# EasyEDA Pro project ProProject_Quantum Mega_v0.2_2024-08-26.epro, board MainPCB
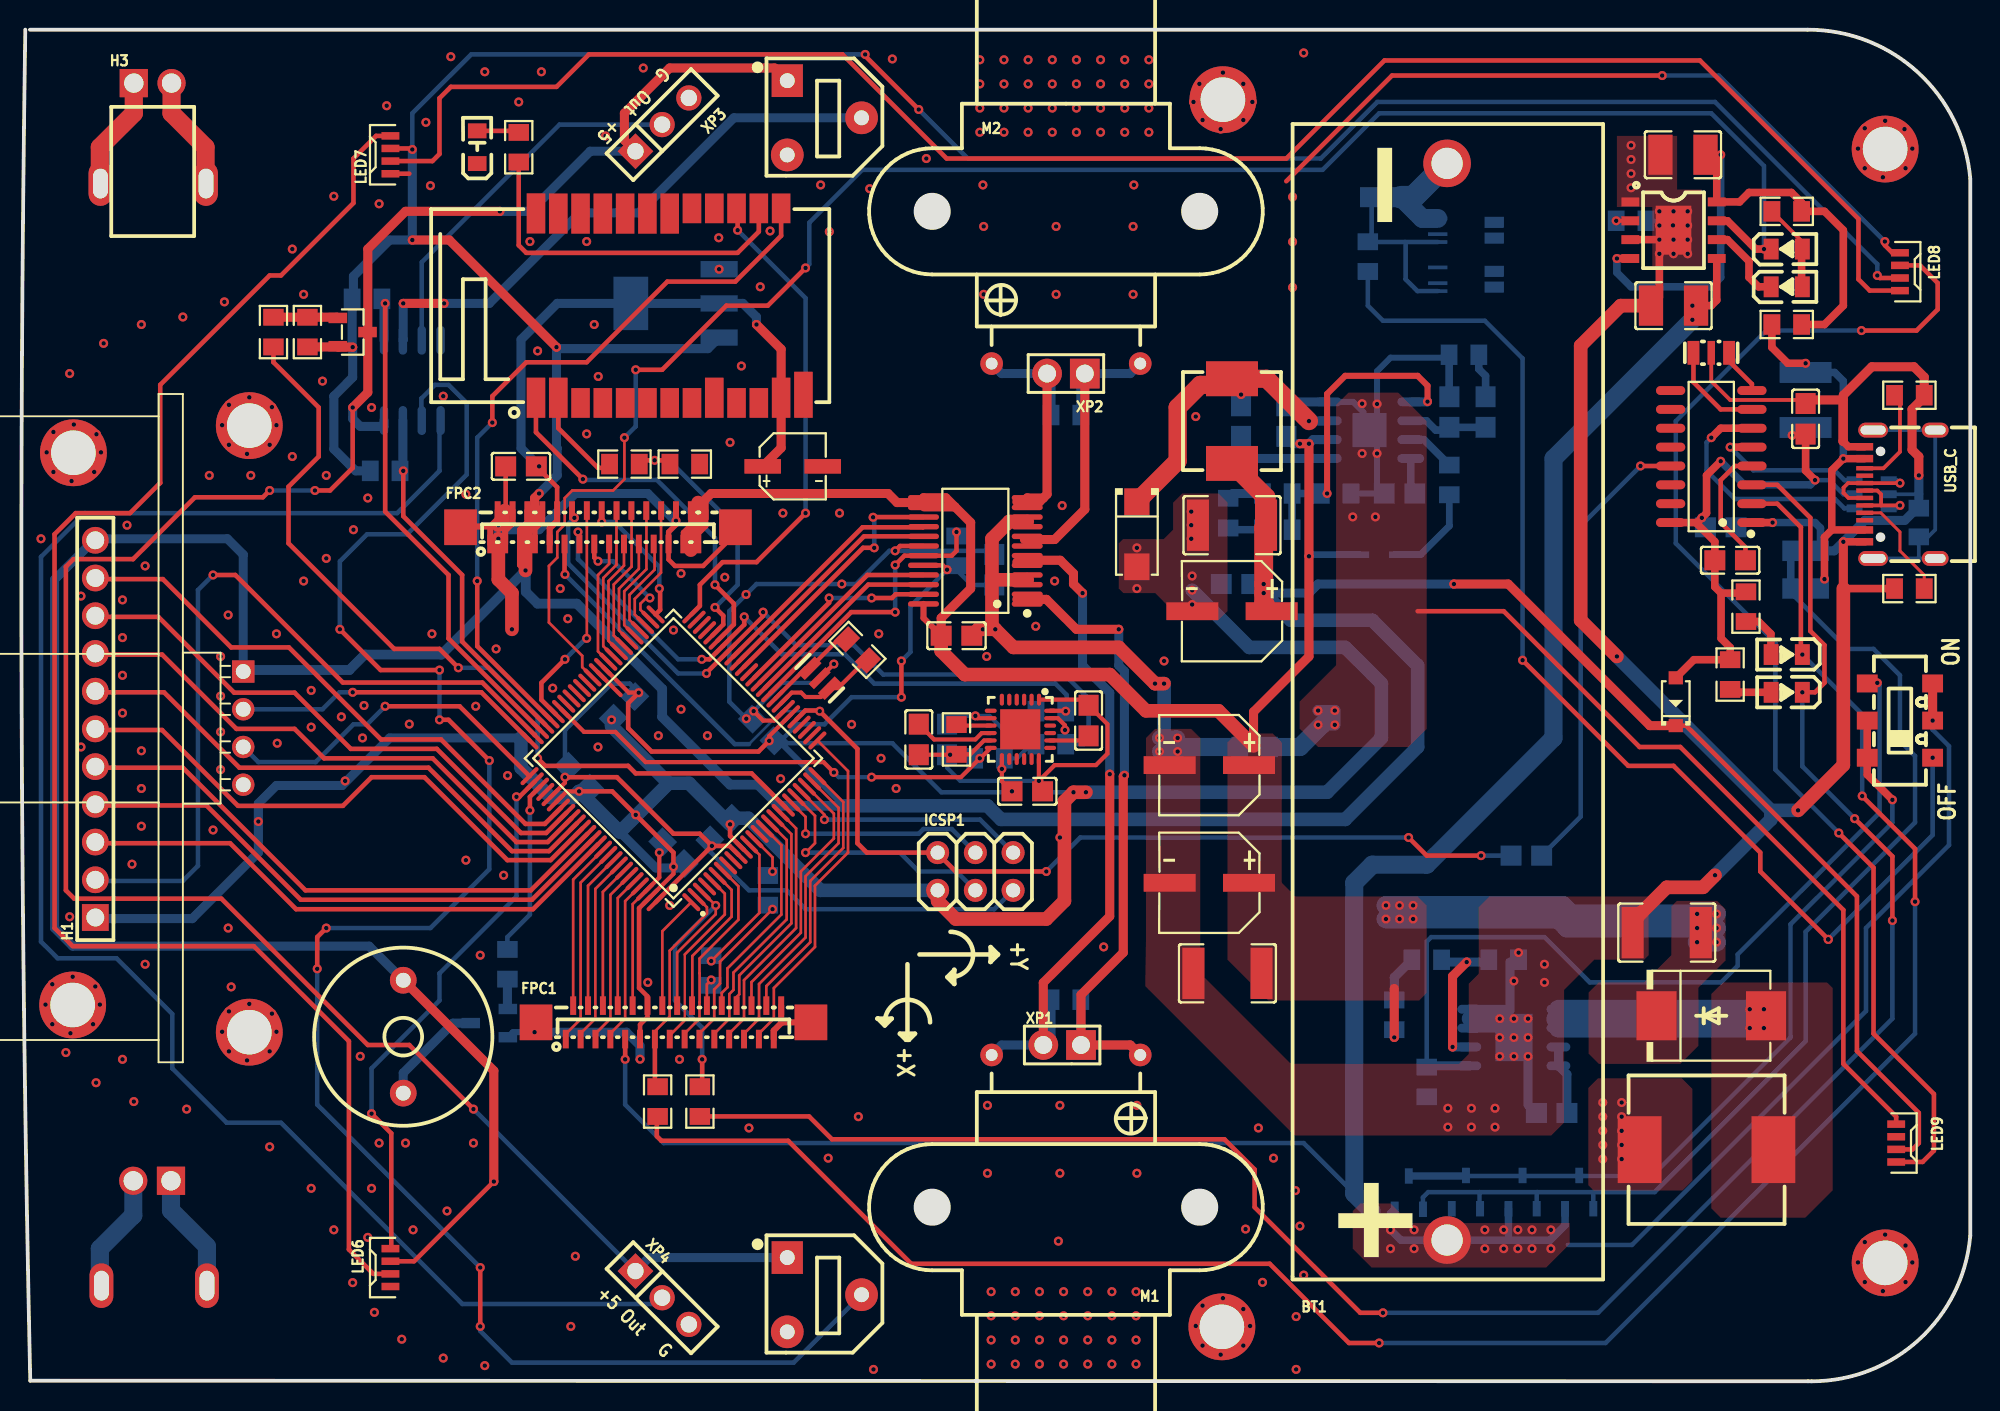
[diagram p3: board, top side]
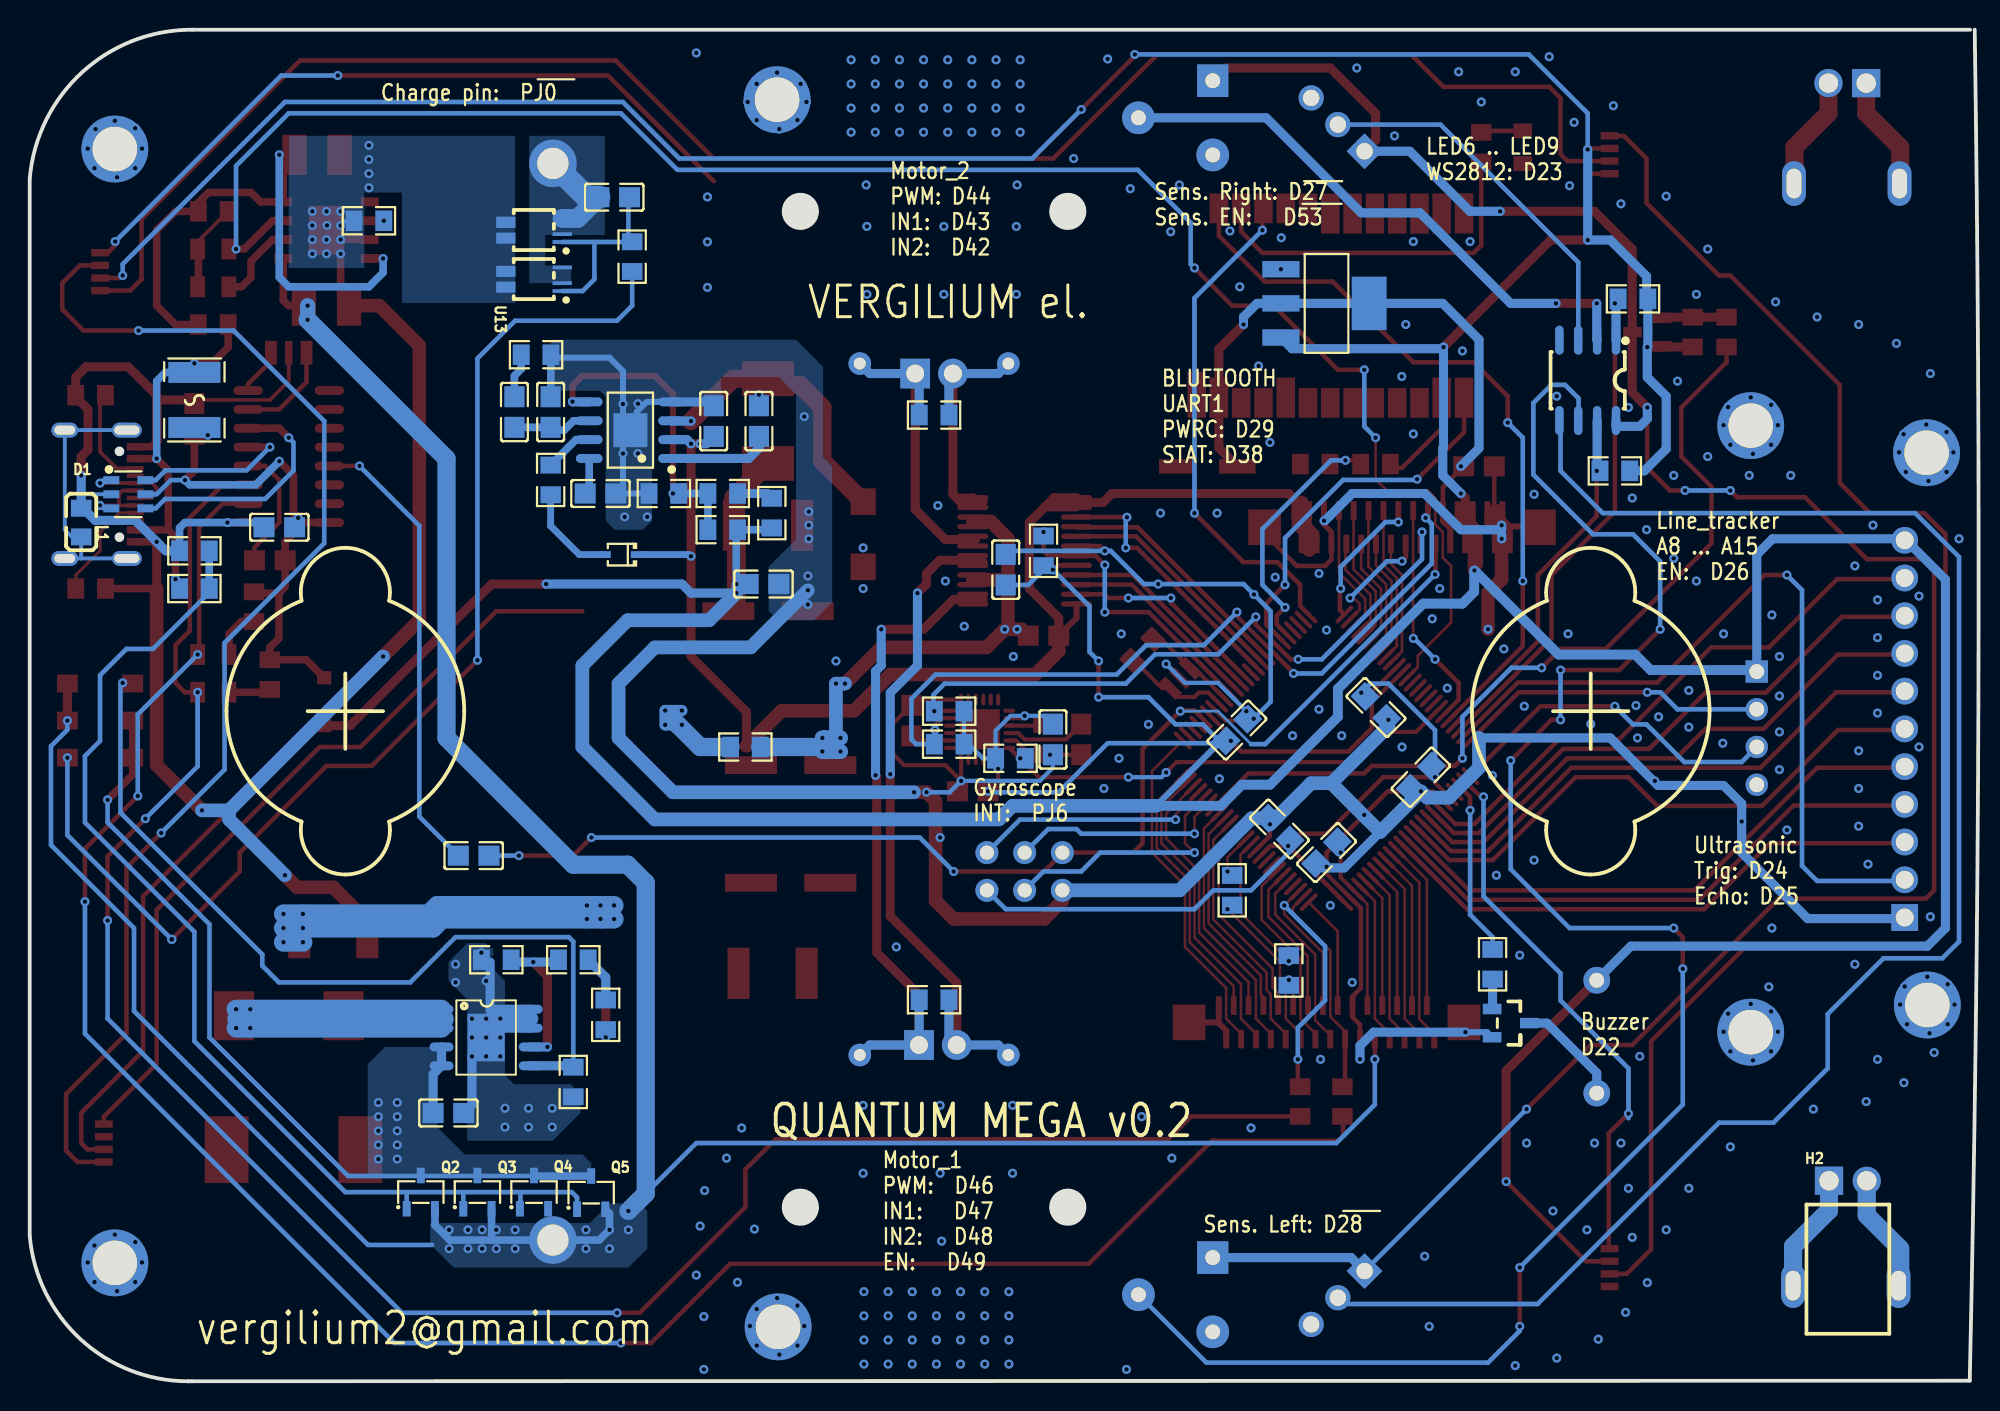
[diagram p4: board, bottom side, seen from below]

Outline 130.61 x 91.01 mm; copper layers: Top Layer, Bottom Layer. Coordinates in mm from the lower left corner of the outline.
Outline path: 0.02,91.01 119.66,91.01 arc(127.1,88.13) 130.61,80.97 130.61,9.8 arc(127.18,2.82) 119.93,0 arc(119.81,0) 119.7,0 0.04,0.04 arc(0,45.53) 0.02,91.01
Stack: Top Layer 0.035mm / Dielectric1 1.51mm FR4 er 4.5 / Bottom Layer 0.035mm

## Design rules (mm)
template: Custom Config
spacing copperThickness1oz (default): track to track 0.102, other pairs 0.152 to 0.3
spacing copperThickness2oz: track to track 0.203, other pairs 0.152 to 0.3
track width copperThickness1oz (default): min 0.127, default 0.254, max 2.54
track width copperThickness2oz: min 0.203, default 0.254, max 2.54
differential pair differentialPair (default): width min 0.127, default 0.254, max 2.54; gap min 0.152, default 0.152
via viaSize (default): diameter min 0.5, default 0.61, max 10; hole min 0.3, default 0.305, max 6.3
net GND uses copperRegionMy

## Placement (name value [footprint] x y rotation side)
BT1  BH-18650-A5BJ001  [bat-th_18650-a5bj001]  95.4 45.76 90 top
BUZZER1  buzzer-12X9  [BUZ-TH_BD12.0-P7.60-D0.6-FD]  25.14 23.2 270 top
C1  0.1u  [C0805]  64.92 54.65 90 bottom
C2  0.1u  [C0805]  62.38 50.2 0 top
C3  10n  [R0805]  69.74 65.06 180 bottom
C4  10n  [R0805]  69.74 25.69 180 bottom
C5  0.1u  [C0805]  36.98 40.68 314.1 bottom
C6  0.1u  [C0805]  40 45.38 225 bottom
C7  0.1u  [C0805]  49.36 43.85 135 bottom
C8  0.1u  [C0805]  46.5 37.19 45 bottom
C9  0.1u  [C0805]  43.33 35.6 315 bottom
C10  0.1u  [C0805]  119.53 64.81 90 top
C11  0.1u  [C0805]  113.81 57.51 180 bottom
C12  0.1u  [C0805]  114.45 55.28 180 top
C13  0.1u  [C0805]  100.73 35.4 180 bottom
C14  10uF  [C1210]  110.64 72.43 0 top
C15  10uF  [C1210]  111.27 82.59 0 top
C16  1uF  [C0805]  102.43 18.07 180 bottom
C17  22uF  [C1812]  80.62 27.47 180 top
C18  22uF  [C1812]  110.18 30.21 0 top
C19  220UF/16V  [CAP-SMD_BD6.3-L6.6-W6.6-LS7.2-FD]  79.4 41.49 180 top
C20  220UF/16V  [CAP-SMD_BD6.3-L6.6-W6.6-LS7.2-FD]  79.4 33.57 180 top
C21  0.1u  [C0805]  92.2 59.78 180 bottom
C22  10n  [C0805]  81.53 64.66 270 bottom
C23  22u  [C1812]  80.92 57.65 0 top
C24  220uF  [CAP-SMD_BD6.3-L6.6-W6.6-LS7.2-FD]  80.92 51.86 180 top
C25  3.9n  [C0805]  97.99 65.27 90 bottom
C26  (optional)  [C0805]  95.55 65.27 90 bottom
C27  0.1u  [C0805]  33.07 61.61 180 top
C28  10u  [CAP-SMD_BD4.0-L4.3-W4.3-LS5.3-FD]  51.36 61.61 0 top
C29  0.1u  [C0805]  81.23 53.68 180 bottom
C30  0.1u  [C0805]  91.27 79.73 180 bottom
C31  2.2n  [C0805]  71.27 44.49 90 top
C32  0.1u  [C0805]  67.14 39.73 0 top
C33  0.1u  [C0805]  59.84 43.22 270 top
C34  10n  [C0805]  61.74 43.22 270 bottom
C35  0.1u  [C0805]  84.58 64.66 270 bottom
D1  USBLC6-2SC6  [SOT-23-6_L2.9-W1.6-P0.95-LS2.8-BL]  123.97 59.73 270 bottom
D2  MBR0520  [SOD-123_L2.7-W1.6-LS3.7-FD]  110.79 45.76 270 top
D3  B130L-13-F  [SMA_L4.4-W2.6-LS5.0-RD]  74.52 57.04 270 top
D4  BZT52C5V1SG  [SOD-323_L1.7-W1.3-LS2.7-RD]  90.83 55.67 0 bottom
D5  SS54  [SMC_L6.9-W5.9-LS7.9-RD]  113.18 24.61 0 top
FPC1  FFC05012-30SSA124W5M  [FPC-SMD_FFC05012-30SSA124W5M]  43.33 24.17 0 top
FPC2  FFC05012-30SSA124W5M  [FPC-SMD_FFC05012-30SSA124W5M]  38.25 57.51 0 top
FU1  MF-MSMF050-2  [F1812]  119.53 66.08 270 bottom
H1  PM2.54-1*11  [HDR-TH_11P-P2.54-V-F]  4.42 43.93 90 top
H2  A2541HWR-2P  [HDR-TH_2P-P2.54-H-W8.7_A2541HWR-2P]  8.24 13.5 180 bottom
H3  A2541HWR-2P  [HDR-TH_2P-P2.54-H-W8.7_A2541HWR-2P]  8.28 87.42 0 top
ICSP1  3x2M  [2X03]  63.65 34.33 180 top
L1  BLM21BD152SH1D  [L0805]  127.15 57.82 270 bottom
L2  10uH  [IND-SMD_L7.2-W6.6_GPSR07X0]  80.92 64.66 270 top
L3  2.2uH  [IND-SMD_L10.5-W10.0]  112.86 15.6 0 top
LED1  Tx  [LED0805-R-RD_GREEN]  118.26 48.93 180 top
LED2  Rx  [LED0805-R-RD_GREEN]  118.26 46.39 180 top
LED3  CHRG  [LED0805-R-RD_GREEN]  118.26 76.24 0 top
LED4  STBY  [LED0805-R-RD_GREEN]  118.26 73.7 0 top
LED5  BT  [LED0805-RD_GREEN]  30.12 83.1 90 top
LED6  WS2812E-4020  [LED-SMD_4P-L4.0-W1.7-R]  24.28 7.66 90 top
LED7  WS2812E-4020  [LED-SMD_4P-L4.0-W1.7-R]  24.28 82.59 90 top
LED8  WS2812E-4020  [LED-SMD_4P-L4.0-W1.7-R]  125.88 74.72 270 top
LED9  WS2812E-4020  [LED-SMD_4P-L4.0-W1.7-R]  125.62 16.04 270 top
M1  Motor_DC  [n20_dc_motor 3d]  69.74 11.72 270 top
M2  Motor_DC  [n20_dc_motor 3d]  69.74 78.78 90 top
NOREF  -  [Pad_e927]  11.93 6.44 0 top
NOREF#2  -  [Pad_e1118]  80.24 3.67 0 top
NOREF#3  -  [Pad_e1115]  124.88 82.98 0 top
NOREF#4  -  [Pad_e4633]  14.78 23.51 0 top
NOREF#5  -  [Pad_e4632]  2.94 62.52 0 top
NOREF#6  -  [Pad_e2358]  11.86 80.65 0 top
NOREF#7  -  [Pad_e1117]  124.88 7.97 0 top
NOREF#8  -  [Pad_e917]  4.82 6.44 0 top
NOREF#9  -  [Pad_e3813]  80.31 86.3 0 top
NOREF#10  -  [Pad_e4634]  2.89 25.34 0 top
NOREF#11  -  [Pad_e4631]  14.78 64.35 0 top
NOREF#12  -  [Pad_e2354]  4.76 80.65 0 top
Q1  BC817  [SOT-23(SOT-23-3)]  30.93 24.12 270 bottom
Q2  RM3401  [SOT-23-3_L2.9-W1.3-P1.90-LS2.8-BR]  104.29 12.74 270 bottom
Q3  RM3401  [SOT-23-3_L2.9-W1.3-P1.90-LS2.8-BR]  100.48 12.74 270 bottom
Q4  RM3401  [SOT-23-3_L2.9-W1.3-P1.90-LS2.8-BR]  96.67 12.74 270 bottom
Q5  RM3401  [SOT-23-3_L2.9-W1.3-P1.90-LS2.8-BR]  92.82 12.7 270 bottom
Q6  IRLML6402  [SOT-23-3_L2.9-W1.3-P1.90-LS2.4-BR]  21.74 70.65 180 top
R0  000  [R0805]  82.44 42.71 0 bottom
R1  1k  [R0805]  32.15 28.08 90 bottom
R2  1M  [R0805]  55.71 49.25 135 top
R3  5.1k  [R0805]  126.51 53.38 0 top
R4  5.1k  [R0805]  126.51 66.4 180 top
R5  1k  [R0805]  115.52 52.16 270 top
R6  1k  [R0805]  114.45 47.59 270 top
R7  1k  [R0805]  42.26 18.84 270 top
R8  1k  [R0805]  45.11 18.84 270 top
R9  10k  [R0805]  62.38 55.92 90 bottom
R10  0.3  [R0805]  118.26 71.16 0 top
R11  1.2k  [R0805]  107.78 78.14 0 bottom
R12  1k  [R0805]  118.26 78.78 0 top
R13  1k  [R0805]  90.06 75.73 270 bottom
R14  1k  [R0805]  119.53 53.38 0 bottom
R15  100k  [R0805]  119.53 55.92 0 bottom
R16  100k  [R0805]  94.03 20.16 90 bottom
R17  82k  [R0805]  94.03 28.39 0 bottom
R18  10k  [R0805]  99.21 28.39 0 bottom
R19  10k  [R0805]  95.55 60.69 90 bottom
R20  6.8k  [R0805]  96.53 69.12 0 bottom
R21  82k  [R0805]  83.97 59.78 180 bottom
R22  82k  [R0805]  83.97 57.34 180 bottom
R23  10k  [R0805]  87.93 59.78 180 bottom
R24  100  [R0805]  45.87 27.66 270 bottom
R25  100  [R0805]  49.68 33.06 270 bottom
R26  10k  [R0805]  62.38 43.22 270 top
R27  10k  [R0805]  64.6 41.95 180 bottom
R28  10k  [R0805]  68.73 45.12 180 bottom
R29  10k  [R0805]  68.73 42.9 180 bottom
R30  10k  [R0805]  22.7 72.89 0 bottom
R31  10k  [RES-ADJ-SMD_RM065-V1]  53.49 85.08 270 top
R32  10k  [R0805]  23.92 61.3 0 bottom
R33  10k  [RES-ADJ-SMD_RM065-V1]  53.49 5.83 270 top
R34  2k  [R0805]  44.09 61.76 180 top
R35  1k  [R0805]  40.03 61.76 180 top
R36  470  [R0805]  32.91 83.1 90 top
R37  47k  [R0805]  18.69 70.65 90 top
R38  2.2k  [R0805]  16.4 70.65 90 top
R39  5.1k  [R0805]  91.84 24.68 90 bottom
R40  5.1k  [R0805]  80.67 58.46 90 bottom
SW2  PWR  [SW-SMD_NIDEC_CL-SB-22B-XX]  125.88 44.49 90 top
U1  ATMEGA2560-16AU  [TQFP-100_L14.0-W14.0-P0.50-LS16.0-BL]  43.33 41.95 45 top
U2  CH340G  [SOIC-16_L9.9-W3.9-P1.27-LS6.0-BL]  113.18 62.27 90 top
U3  JDY-24M  [BULETM-SMD_JDY-24M]  43.07 72.43 90 top
U4  TB6612FNG  [SSOP-24_L8.4-W5.8-P0.65-LS7.8-BL]  63.65 55.92 90 top
U5  HC-SR04  [ULTRASONIC-HC-SR04#V]  14.37 43.98 270 top
U6  TP4056  [ESOP-8_L4.9-W3.9-P1.27-LS6.0-BL-EP]  110.64 77.51 270 top
U7  XB7608AJ  [CPC-5_L2.6-W2.6-P0.53-LS4.0-BL]  96.67 77.51 90 bottom
U8  XR2981  [SO-8_L4.9-W3.9-P1.27-LS6.0-BL-EP]  99.89 23.15 270 bottom
U9  MP2307DN  [SOP-8_L4.9-W3.9-P1.27-LS6.0-BL-EP]  90.18 64.04 90 bottom
U10  AMS1117-3.3  [SOT-223-3_L6.5-W3.4-P2.30-LS7.0-BR]  43.43 72.58 0 bottom
U11  MPU-6050  [QFN-24_L4.0-W4.0-P0.50-BL-EP2.7]  66.68 43.9 180 top
U12  LM393DR2G  [SOIC-8_L5.0-W4.0-P1.27-LS6.0-BL]  25.75 67.4 0 bottom
U13  XB7608AJ  [CPC-5_L2.6-W2.6-P0.53-LS4.0-BL]  96.67 74.21 90 bottom
USB_C  USB-C-SMD-DIP_TYPEC-缩减引脚  [USB-C-SMD_C9900005364]  125.88 59.73 90 top
X1  16MHz  [OSC-SMD_3P-L3.2-W1.3-P0.95-L]  53.17 47.35 135 top
X2  12MHz  [CRYSTAL-SMD_3P-L3.2-W1.3-P1.2-L]  113.18 69.25 180 top
XP1  2.54-1*2  [HDR-TH_2P-P2.54-V-M]  69.49 22.65 180 top
XP2  2.54-1*2  [HDR-TH_2P-P2.54-V-M]  69.74 67.86 180 top
XP3  D32  [HDR-TH_3P-P2.54-V-M]  42.57 84.62 45 top
XP4  D32  [HDR-TH_3P-P2.54-V-M]  42.57 5.63 315 top

## Footprints (pads in the part's own frame, mm; a bottom-side part is the same pattern mirrored in y, then rotated)
2X03
  rrect 1.55x1.55 hole 0.95: 1(-2.54,-1.27) 2(-2.54,1.27) 3(0,-1.27) 4(0,1.27) 5(2.54,-1.27) 6(2.54,1.27)
bat-th_18650-a5bj001
  round 3.2 hole 2.1: 1(-36.25,0) 2(36.25,0)
BULETM-SMD_JDY-24M
  rect 2.7x1.25 smd: 1(-6.2,9) 2(-6.2,7.5) 9(-6.2,-3) 12(-6.2,-7.5) 19(6.2,0) 20(6.2,1.5) 21(6.2,3) 22(6.2,4.5) 23(6.2,6) 24(6.2,7.5) 25(6.21,9)
  rect 2x1.25 smd: 3(-6.55,6) 4(-6.55,4.5) 5(-6.55,3) 6(-6.55,1.5) 7(-6.55,0) 8(-6.55,-1.5) 10(-6.55,-4.5) 11(-6.55,-6) 14(6.55,-7.5) 15(6.55,-6) 16(6.55,-4.5) 17(6.55,-3) 18(6.55,-1.5)
  rect 3.1x1.25 smd: 13(-6,-9)
BUZ-TH_BD12.0-P7.60-D0.6-FD
  round 1.8 hole 1: 1(-3.8,0) 2(3.8,0)
C0805
  rect 1.41x1.35 smd: 1(-1.03,0) 2(1.03,0)
C1210
  rect 1.635x2.7 smd: 1(-1.518,0) 2(1.518,0)
C1812
  rect 1.485x3.456 smd: 1(-2.292,0) 2(2.292,0)
CAP-SMD_BD4.0-L4.3-W4.3-LS5.3-FD
  rect 2.46x0.98 smd: 1(-2.02,0) 2(2.02,0)
CAP-SMD_BD6.3-L6.6-W6.6-LS7.2-FD
  rect 3.5x1.2 smd: 1(-2.67,0) 2(2.67,0)
CPC-5_L2.6-W2.6-P0.53-LS4.0-BL
  rect 0.25x1.3 smd: 1(-0.795,-1.9) 2(-0.265,-1.9) 3(0.795,-1.9)
  rect 0.75x1.3 smd: 4(0.53,1.9) 5(-0.53,1.9)
CRYSTAL-SMD_3P-L3.2-W1.3-P1.2-L
  rect 0.8x1.6 smd: 1(-1.199,0) 3(1.199,0)
  rect 0.5x1.6 smd: 2(0,0)
ESOP-8_L4.9-W3.9-P1.27-LS6.0-BL-EP
  rect 0.6x1.2 smd: 1(-1.905,-2.909) 2(-0.635,-2.909) 3(0.635,-2.909) 4(1.905,-2.909) 5(1.905,2.909) 6(0.635,2.909) 7(-0.635,2.909) 8(-1.905,2.909)
  rect 3.3x2.4 smd: 9(0,0)
F1812
  rect 1.407x3.499 smd: 1(-1.853,0) 2(1.853,0)
FPC-SMD_FFC05012-30SSA124W5M
  rect 0.4x1.25 smd: 1(-7.25,-1.125) 2(-6.75,1.125) 3(-6.25,-1.125) 4(-5.75,1.125) 5(-5.25,-1.125) 6(-4.75,1.125) 7(-4.25,-1.125) 8(-3.75,1.125) 9(-3.25,-1.125) 10(-2.75,1.125) 11(-2.25,-1.125) 12(-1.75,1.125) 13(-1.25,-1.125) 14(-0.75,1.125) 15(-0.25,-1.125) 16(0.25,1.125) 17(0.75,-1.125) 18(1.25,1.125) 19(1.75,-1.125) 20(2.25,1.125) 21(2.75,-1.125) 22(3.25,1.125) 23(3.75,-1.125) 24(4.25,1.125) 25(4.75,-1.125) 26(5.25,1.125) 27(5.75,-1.125) 28(6.25,1.125) 29(6.75,-1.125) 30(7.25,1.125)
  rect 2.2x2.4 smd: 31(9.25,0) 32(-9.25,0)
HDR-TH_2P-P2.54-H-W8.7_A2541HWR-2P
  rect 1.9x1.9 hole 1.3: 1(-1.27,0)
  round 1.9 hole 1.3: 2(1.27,0)
HDR-TH_2P-P2.54-V-M
  rect 2x2 hole 1.2: 1(-1.27,0)
  round 2 hole 1.2: 2(1.27,0)
HDR-TH_3P-P2.54-V-M
  rect 1.7x1.7 hole 1.1: 1(-2.54,0)
  round 1.7 hole 1.1: 2(0,0) 3(2.54,0)
HDR-TH_11P-P2.54-V-F
  rect 1.8x1.8 hole 1.2: 1(-12.7,0)
  round 1.8 hole 1.2: 2(-10.16,0) 3(-7.62,0) 4(-5.08,0) 5(-2.54,0) 6(0,0) 7(2.54,0) 8(5.08,0) 9(7.62,0) 10(10.16,0) 11(12.7,0)
IND-SMD_L7.2-W6.6_GPSR07X0
  rect 2.35x3.5 smd: 1(-2.85,0) 2(2.85,0)
IND-SMD_L10.5-W10.0
  rect 2.95x4.5 smd: 1(-4.5,0) 2(4.5,0)
L0805
  rect 1.133x1.377 smd: 1(-0.966,0) 2(0.966,0)
LED0805-R-RD_GREEN
  rect 1x1.399 smd: 1(1.05,0) 2(-1.05,0)
LED0805-RD_GREEN
  rect 1x1.25 smd: 1(-1.1,0) 2(1.1,0)
LED-SMD_4P-L4.0-W1.7-R
  rect 0.5x1.2 smd: 1(1.275,0) 2(0.425,0) 3(-0.425,0) 4(-1.275,0)
n20_dc_motor 3d
  round 1.524 hole 0.8: 1(-10.25,5) 2(-10.25,-5)
OSC-SMD_3P-L3.2-W1.3-P0.95-L
  rect 0.65x1.6 smd: 1(-0.95,0) 3(0.95,0)
  rect 0.5x1.6 smd: 2(0,0)
Pad_e917
  oval 1.6x3 hole 1x2: 102(0,0)
Pad_e927
  oval 1.6x3 hole 1x2: 103(0,0)
Pad_e1115
  round 4.5 hole 3: 101(0,0)
Pad_e1117
  round 4.5 hole 3: 101(0,0)
Pad_e1118
  round 4.5 hole 3: 101(0,0)
Pad_e2354
  oval 1.6x3 hole 1x2: 102(0,0)
Pad_e2358
  oval 1.6x3 hole 1x2: 103(0,0)
Pad_e3813
  round 4.5 hole 3: 101(0,0)
Pad_e4631
  round 4.5 hole 3: 101(0,0)
Pad_e4632
  round 4.5 hole 3: 101(0,0)
Pad_e4633
  round 4.5 hole 3: 101(0,0)
Pad_e4634
  round 4.5 hole 3: 101(0,0)
QFN-24_L4.0-W4.0-P0.50-BL-EP2.7
  oval 0.28x0.8 smd: 1(-1.25,-2) 2(-0.75,-2) 3(-0.25,-2) 4(0.25,-2) 5(0.75,-2) 6(1.25,-2) 13(1.25,2) 14(0.75,2) 15(0.25,2) 16(-0.25,2) 17(-0.75,2) 18(-1.242,2)
  oval 0.8x0.28 smd: 7(2,-1.25) 8(2,-0.75) 9(2,-0.25) 10(2,0.25) 11(2,0.75) 12(2,1.25) 19(-2,1.25) 20(-2,0.75) 21(-2,0.25) 22(-2,-0.25) 23(-2,-0.75) 24(-2,-1.25)
  rect 2.7x2.7 smd: 25(0.013,0)
R0805
  rect 1.133x1.377 smd: 1(-1,0) 2(1,0)
RES-ADJ-SMD_RM065-V1
  rect 2.2x2.1 hole 1: 1(-2.5,-2.5)
  round 2.2 hole 1: 2(0,2.5) 3(2.5,-2.5)
SMA_L4.4-W2.6-LS5.0-RD
  rect 1.8x1.7 smd: 1(-2.192,0) 2(2.192,0)
SMC_L6.9-W5.9-LS7.9-RD
  rect 2.7x3.3 smd: 1(-3.687,0) 2(3.687,0)
SO-8_L4.9-W3.9-P1.27-LS6.0-BL-EP
  oval 0.6x1.6 smd: 1(-1.905,-3) 2(-0.635,-3) 3(0.635,-3) 4(1.905,-3) 5(1.905,3) 6(0.635,3) 7(-0.635,3) 8(-1.905,3)
  rect 3.2x2.5 smd: 9(0,0)
SOD-123_L2.7-W1.6-LS3.7-FD
  rect 0.88x0.96 smd: 1(-1.61,0) 2(1.61,0)
SOD-323_L1.7-W1.3-LS2.7-RD
  rect 0.845x0.455 smd: 1(-1.097,0) 2(1.097,0)
SOIC-8_L5.0-W4.0-P1.27-LS6.0-BL
  oval 0.569x1.95 smd: 1(-1.905,-2.705) 2(-0.635,-2.705) 3(0.635,-2.705) 4(1.905,-2.705) 5(1.905,2.705) 6(0.635,2.705) 7(-0.635,2.705) 8(-1.905,2.705)
SOIC-16_L9.9-W3.9-P1.27-LS6.0-BL
  oval 0.602x1.971 smd: 1(-4.445,-2.736) 2(-3.175,-2.736) 3(-1.905,-2.736) 4(-0.635,-2.736) 5(0.635,-2.736) 6(1.905,-2.736) 7(3.175,-2.736) 8(4.445,-2.736) 9(4.445,2.736) 10(3.175,2.736) 11(1.905,2.736) 12(0.635,2.736) 13(-0.635,2.736) 14(-1.905,2.736) 15(-3.175,2.736) 16(-4.445,2.736)
SOP-8_L4.9-W3.9-P1.27-LS6.0-BL-EP
  oval 0.6x1.8 smd: 1(-1.905,-2.772) 2(-0.635,-2.772) 3(0.635,-2.772) 4(1.905,-2.772) 5(1.905,2.772) 6(0.635,2.772) 7(-0.635,2.772) 8(-1.905,2.772)
  rect 2.29x2.29 smd: 9(0,0)
SOT-23(SOT-23-3)
  rect 0.7x1.25 smd: 1(-0.95,-1.25) 2(0.95,-1.25) 3(0,1.25)
SOT-23-3_L2.9-W1.3-P1.90-LS2.4-BR
  rect 1.25x0.7 smd: 1(1,-0.95) 2(1,0.95) 3(-1,0)
SOT-23-3_L2.9-W1.3-P1.90-LS2.8-BR
  rect 1.04x0.532 smd: 1(1.12,-0.95) 2(1.12,0.95) 3(-1.12,0)
SOT-23-6_L2.9-W1.6-P0.95-LS2.8-BL
  rect 0.532x1.072 smd: 1(-0.95,-1.149) 2(0,-1.149) 3(0.95,-1.149) 4(0.95,1.149) 5(0,1.149) 6(-0.95,1.149)
SOT-223-3_L6.5-W3.4-P2.30-LS7.0-BR
  rect 2.5x1.1 smd: 1(2.97,-2.3) 2(2.97,0) 3(2.97,2.3)
  rect 2.34x3.6 smd: 4(-2.97,0)
SSOP-24_L8.4-W5.8-P0.65-LS7.8-BL
  oval 0.364x2.082 smd: 1(-3.575,-3.491) 2(-2.925,-3.491) 3(-2.275,-3.491) 4(-1.625,-3.491) 5(-0.975,-3.491) 6(-0.325,-3.491) 7(0.325,-3.491) 8(0.975,-3.491) 9(1.625,-3.491) 10(2.275,-3.491) 11(2.925,-3.491) 12(3.575,-3.491) 13(3.575,3.491) 14(2.925,3.491) 15(2.275,3.491) 16(1.625,3.491) 17(0.975,3.491) 18(0.325,3.491) 19(-0.325,3.491) 20(-0.975,3.491) 21(-1.625,3.491) 22(-2.275,3.491) 23(-2.925,3.491) 24(-3.575,3.491)
SW-SMD_NIDEC_CL-SB-22B-XX
  rect 1.2x1.4 smd: 1(-2.5,-2.2) 2(0,-2.2) 3(2.5,-2.2) 4(-2.5,2.2) 5(0,2.2) 6(2.5,2.2)
TQFP-100_L14.0-W14.0-P0.50-LS16.0-BL
  oval 0.28x1.6 smd: 1(-6,-7.7) 2(-5.5,-7.7) 3(-5,-7.7) 4(-4.5,-7.7) 5(-4,-7.7) 6(-3.5,-7.7) 7(-3,-7.7) 8(-2.5,-7.7) 9(-2,-7.7) 10(-1.5,-7.7) 11(-1,-7.7) 12(-0.5,-7.7) 13(0,-7.7) 14(0.5,-7.7) 15(1,-7.7) 16(1.5,-7.7) 17(2,-7.7) 18(2.5,-7.7) 19(3,-7.7) 20(3.5,-7.7) 21(4,-7.7) 22(4.5,-7.7) 23(5,-7.7) 24(5.5,-7.7) 25(6,-7.7) 51(6,7.7) 52(5.5,7.7) 53(5,7.7) 54(4.5,7.7) 55(4,7.7) 56(3.5,7.7) 57(3,7.7) 58(2.5,7.7) 59(2,7.7) 60(1.5,7.7) 61(1,7.7) 62(0.5,7.7) 63(0,7.7) 64(-0.5,7.7) 65(-1,7.7) 66(-1.5,7.7) 67(-2,7.7) 68(-2.5,7.7) 69(-3,7.7) 70(-3.5,7.7) 71(-4,7.7) 72(-4.5,7.7) 73(-5,7.7) 74(-5.5,7.7) 75(-6,7.7)
  oval 1.6x0.28 smd: 26(7.7,-6) 27(7.7,-5.5) 28(7.7,-5) 29(7.7,-4.5) 30(7.7,-4) 31(7.7,-3.5) 32(7.7,-3) 33(7.7,-2.5) 34(7.7,-2) 35(7.7,-1.5) 36(7.7,-1) 37(7.7,-0.5) 38(7.7,0) 39(7.7,0.5) 40(7.7,1) 41(7.7,1.5) 42(7.7,2) 43(7.7,2.5) 44(7.7,3) 45(7.7,3.5) 46(7.7,4) 47(7.7,4.5) 48(7.7,5) 49(7.7,5.5) 50(7.7,6) 76(-7.7,6) 77(-7.7,5.5) 78(-7.7,5) 79(-7.7,4.5) 80(-7.7,4) 81(-7.7,3.5) 82(-7.7,3) 83(-7.7,2.5) 84(-7.7,2) 85(-7.7,1.5) 86(-7.7,1) 87(-7.7,0.5) 88(-7.7,0) 89(-7.7,-0.5) 90(-7.7,-1) 91(-7.7,-1.5) 92(-7.7,-2) 93(-7.7,-2.5) 94(-7.7,-3) 95(-7.7,-3.5) 96(-7.7,-4) 97(-7.7,-4.5) 98(-7.7,-5) 99(-7.7,-5.5) 100(-7.7,-6)
ULTRASONIC-HC-SR04#V
  rect 1.508x1.508 hole 1: 1(-3.81,0)
  round 1.508 hole 1: 2(-1.27,0) 3(1.27,0) 4(3.81,0)
USB-C-SMD_C9900005364
  oval 1x2 hole 0.6x1.7: 1(-4.32,1.806) 1(4.32,1.806)
  oval 1x1.8 hole 0.6x1.4: 1(-4.32,-2.374) 1(4.32,-2.374)
  rect 0.5x1.14 smd: A1B12(-3.2,2.373) A4B9(-2.4,2.373) B1A12(3.2,2.373) B4A9(2.4,2.373)
  rect 0.3x1.14 smd: A5(-1.25,2.373) A6(-0.25,2.373) A7(0.25,2.373) A8(1.25,2.374) B5(1.75,2.373) B6(0.75,2.373) B7(-0.75,2.373) B8(-1.75,2.374)

## Nets
As in the schematic, except:
+3.3V: C27.1 C28.1 FPC2.9 FPC2.10 U3.12 U10.2 U10.4
+12V: C2.1 C17.1 C18.2 C19.1 C20.1 C35.2 D4.1 D5.1 FPC2.27 FPC2.28 FPC2.29 FPC2.30 R39.1 U4.13 U4.14 U4.24 U9.2
GND: C1.2 C5.2 C6.2 C7.2 C8.2 C9.2 C21.2 C23.1 C24.2 C26.2 C27.2 C28.2 C29.2 C31.2 C32.2 C33.2 C34.2 C35.1 D3.2 FPC1.11 FPC1.12 FPC1.29 FPC1.30 FPC1.31 FPC1.32 FPC2.1 FPC2.2 FPC2.3 FPC2.4 FPC2.25 FPC2.26 FPC2.31 FPC2.32 H1.1 ICSP1.6 LED5.1 LED6.4 LED7.4 LED8.4 LED9.4 NOREF#2.101 NOREF#4.101 NOREF#5.101 NOREF#9.101 NOREF#10.101 NOREF#11.101 Q1.2 R0.2 R20.1 R23.1 R26.2 R31.3 R33.3 R34.1 U1.11 U1.32 U1.62 U1.81 U1.99 U3.13 U4.18 U5.4 U9.4 U9.9 U10.1 U11.1 U11.11 U11.18 U12.4 X1.2 XP3.3 XP4.3
AREF: C9.1 FPC1.10 U1.98
IR_LINE1: H1.3 U1.89
IR_LINE2: H1.4 U1.88
IR_LINE3: H1.5 U1.87
IR_LINE4: H1.6 U1.86
IR_LINE5: H1.7 U1.85
IR_LINE6: H1.8 U1.84
IR_LINE7: H1.9 U1.83
IR_LINE8: H1.10 U1.82
SENS_L: R32.2 U1.72 U12.7
SENS_R: R30.2 U1.73 U12.1
~SENS_EN: R38.1 U1.19

Pads without a net: H2 1 2; H3 1 2; LED9 3; NOREF 103; NOREF#3 101; NOREF#6 103; NOREF#7 101; NOREF#8 102; NOREF#12 102; U1 4 8 9 14 27 28 29 39 47 48 49 64 65 66 67 68 79; U2 9 10 11 12 14 15; U3 3 4 5 6 7 8 9 10 11 17 18 19 20 21 22 23 24 25; U11 2 3 4 5 6 7 14 15 16 17 19 21 22 25; USB_C A8 B8

## Via types
v1: diameter 0.61, hole 0.305, Top Layer to Bottom Layer, 576 vias

## Routing (per net, layer and track width the routed paths; a pad name or vN(x,y) marks a point on that pad's centre or on a via; arc(x,y) is an arc through that point)
+3.3V: length 43.6
  Top Layer w0.305: FPC2.10 35.5,60.21 C27.1
  Top Layer w0.406: FPC2.9 35,57.43 35.5,57.93 FPC2.10
  Top Layer w0.61: C28.1 50.57,62.85 U3.12 50.57,69.5 v1(48.92,71.16)
  Bottom Layer w0.61: v1(34.28,61.61) 33.06,62.83 33.06,70.14 35.5,72.58 U10.4 U10.2 48,72.58 48.91,71.67 v1(48.91,71.16)
+5V: length 620.9
  Top Layer w0.28: v1(49.77,43.13) 49.77,43.44 U1.31 ; v1(66.11,39.73) 65.43,40.41 v1(65.43,41.23) U11.13 ; v1(36.02,40.68) 36.02,40.3 35.05,39.33 ; v1(63.65,44.81) 63.8,44.65 U11.8 ; U1.61 40.32,46.37 v1(40.99,46.37)
  Top Layer w0.305: v1(58.67,48.5) v1(58.67,46.06) ; U1.10 47.1,36.05 v1(45.91,36.05) ; v1(124.35,74.46) 124.52,74.29 LED8.2 ; v1(61.74,54.65) 61.45,54.94 U4.20 ; v1(56.23,89.35) 56.23,89.24 v1(59.84,85.64) ; v1(45.91,36.05) 45.09,36.87 43.33,36.87 39.52,40.68 v1(36.02,40.68) ; v1(45.91,36.05) U1.100 ; D2.2 111.48,44.15 122.98,32.65 122.98,22.24 127.15,18.07 127.15,16.04 126.72,15.62 LED9.2 ; v1(31.23,13.45) 25.87,8.08 24.28,8.08 ; v1(49.77,43.13) 49.05,42.41 41.85,42.41 40.28,43.98 40.28,45.66 v1(40.99,46.37) ; LED7.2 25.68,83.01 v1(25.75,82.95)
  Top Layer w0.355: FPC2.7 34,57.38 34.5,57.88 FPC2.8 FPC2.6
  Top Layer w0.406: FPC2.6 33.5,57.84 33,57.34 FPC2.5 33,54.97 v1(33.37,54.6)
  Top Layer w0.61: D2.2 109.04,44.15 99.51,53.68 v1(95.85,53.68) ; v1(25.75,76.85) 28.24,76.85 v1(35.45,69.64) ; v1(21.74,69.64) 20.8,69.64 Q6.2 20.74,69.65 R37.1 ; BUZZER1.1 31.23,20.91 v1(31.23,13.45) ; v1(34.28,59.78) 33.98,59.48 33.98,58.66 34,58.63
  Top Layer w0.914: 34,58.63 34,57.95 33.37,57.32 v1(33.37,54.6)
  Top Layer w1.27: 83.19,52.26 83.05,52.39 v1(83.05,53.07) v1(83.05,53.68) 83.05,57.49 C23.2 83.21,59.51 L2.2
  Bottom Layer w0.28: C34.1 62.3,44.81 v1(63.65,44.81) 64.6,44.81 65.6,43.81 R27.1 66.46,41.95 67.73,43.22 R28.2
  Bottom Layer w0.305: v1(124.35,74.46) 124.35,75.22 113.43,86.15 90.7,86.15 86.89,82.34 63.14,82.34 v1(59.84,85.64) ; v1(49.77,43.13) C7.1 ; v1(58.67,46.06) 55.31,46.06 53.49,44.24 51.66,44.24 50.55,43.13 ; 65.98,39.66 61.36,39.66 58.06,42.97 50.71,42.97 50.55,43.13 ; v1(56.23,89.35) 29.71,89.35 25.75,85.38 v1(25.75,82.95) ; 50.55,43.13 50.42,43.13 ; v1(36.02,40.68) 36.02,43.84 39.16,46.98 40.38,46.98 v1(40.99,46.37) ; C1.1 63.41,53.62 62.38,54.65 v1(61.74,54.65) 59.28,52.19 59.28,49.11 v1(58.67,48.5) ; ICSP1.2 64.92,31.79 52.22,31.79 50.95,33.06 48.41,33.06 45.77,35.69 C8.1
  Bottom Layer w0.406: 50.42,43.13 54.8,38.75
  Bottom Layer w0.508: R40.1 80.78,57.34 R22.2 83.05,57.26 v1(83.05,53.68)
  Bottom Layer w0.61: U5.1 14.37,55.67 13.3,56.73 4.41,56.73 1.67,53.99 1.67,30.52 2.89,29.3 22.84,29.3 BUZZER1.1 ; v1(95.85,53.68) 86.71,53.68 86.1,53.07 v1(83.05,53.07) v1(83.05,53.68) ; v1(34.28,59.78) 35.5,61 35.5,62.83 35.45,62.88 v1(35.45,69.64) 35.55,69.53 45.65,69.53 U10.3 ; v1(25.75,82.95) v1(25.75,76.85) 24.22,76.85 21.79,74.41 21.79,72.97 R30.1 21.7,69.67 v1(21.74,69.64) 21.74,67.6 20.47,66.33 20.47,62.78 21.94,61.3 R32.1
  Bottom Layer w0.66: 33.39,54.58 33.39,53.16 34.18,52.36 36.82,52.36 42.56,46.62 42.56,44.74 47.14,40.17 49.01,40.17 50.44,38.75 54.79,38.75 ; U5.1 14.47,47.89 21.51,47.89 22.55,48.93 27.7,48.93 v1(33.37,54.6)
  Bottom Layer w0.914: 54.79,38.75 64.46,38.75 65.37,37.83 88.54,37.83 93.41,42.71 93.41,48.2 90.37,51.25 84.88,51.25 v1(83.05,53.07) ; 50.42,43.13 C7.1
+12V: length 144.4
  Top Layer w0.355: FPC2.27 44,57.15 44.5,57.65 FPC2.28 ; FPC2.29 45,57.08 45.5,57.58 FPC2.30
  Top Layer w0.406: U4.24 60.15,51.4 C2.1
  Top Layer w0.61: C2.1 61.35,51.4 63.33,53.38 63.33,57.82 62.27,58.88 ; v1(85.49,63.13) v1(86.1,63.13) v1(86.1,55.55) 86.1,48.81 82.37,45.08 82.37,42.78 ; 60.19,58.88 62.27,58.88 ; 62.27,58.88 61.66,59.49 60.16,59.49 U4.13 ; 45.26,59.17 45.87,59.78 57.77,59.78 58.38,59.17 61.11,59.17 ; v1(91.84,23.15) 91.84,26.46
  Top Layer w0.914: 82.37,42.78 80,45.15 75.13,45.15 72.69,47.59 62.93,47.59 61.35,49.18 C2.1 ; 44.99,59.17 44.99,57.68 44.49,57.19 44.49,55.97
  Bottom Layer w0.457: 89.44,55.67 86.21,55.67 v1(86.1,55.55)
  Bottom Layer w0.61: v1(85.49,63.13) 85.07,63.13 C35.2 ; v1(86.1,63.13) 86.37,63.41 U9.2
  Bottom Layer w1.27: v1(113.53,29.57) v1(112.22,29.57) ; v1(113.53,30.52) v1(112.22,30.52) 103.47,30.52 102.86,31.13 v1(93.11,31.13) v1(92.19,31.13) v1(91.28,31.13) ; v1(91.28,32.04) v1(92.19,32.04) v1(93.11,32.04) 103.17,32.04 103.74,31.47 v1(112.22,31.47) v1(113.53,31.47)
GND: length 434.4
  Top Layer w0.28: v1(48.72,45.12) 49.36,44.49 50.11,44.49 U1.32 ; C32.2 67.92,39.97 v1(67.92,40.43) ; U11.18 v1(67.92,40.43) ; v1(67.92,40.43) 68.98,41.49 71.76,41.49 72.54,42.27 72.54,44.25 C31.2 70.88,45.9 U11.1 ; R26.2 63.3,42.22 64.23,43.15 U11.11 ; v1(43.33,34.65) 43.33,34.17 U1.99 ; U1.62 39.77,46.21 ; v1(61.94,42.19) C33.2 ; v1(54.12,48.3) X1.2 ; v1(36.98,39.73) 36.15,39.73 U1.81
  Top Layer w0.305: C27.2 32.03,58.69 31.98,58.63 ; v1(43.33,34.65) 43.33,35.6 v1(40.79,38.14) 39.2,39.73 v1(36.98,39.73) ; U1.11 47.14,36.73 v1(47.14,37.5) ; LED8.4 125.36,75.99 124.86,76.49 v1(124.86,76.75) ; 125.62,17.32 125.62,17.82 122.07,21.38 122.07,31.74 111.09,42.71 108.35,42.71 99.21,51.86 93.41,51.86 ; 24.28,81.31 25.55,81.31 ; U4.18 58.57,56.24 v1(58.25,55.92) ; FPC2.25 43,55.34 43.43,54.9 45.32,54.9 47.5,57.08 FPC2.31 ; v1(109.87,87.92) 91.69,87.92 84.57,80.81 ; U1.99 41.01,31.86 41.01,26.48 41.58,25.92 FPC1.12 41.58,24.52 41.08,24.02 FPC1.11
  Top Layer w0.355: FPC2.25 43,57.18 43.5,57.69 FPC2.26 ; FPC2.2 FPC2.4
  Top Layer w0.406: 31,57.56 29.05,57.56 FPC2.32 ; 31,57.56 FPC2.1 ; 31,57.56 31.5,58.06 FPC2.2 ; FPC2.3 32,57.29 32.5,57.79 FPC2.4 ; FPC1.31 50.63,24.17 50.58,24.12 ; 50.58,24.12 FPC1.30 ; 50.58,24.12 50.08,23.62 FPC1.29
  Top Layer w0.914: v1(32.45,50.64) 32.45,53.07 31.54,53.99 v1(31.54,56.73) ; v1(71.09,39.66) v1(70.25,39.66) 69.64,39.05 69.64,32.35 68.42,31.13 62.32,31.13 61.11,32.35 ICSP1.6 ; 31.98,58.63 31.84,58.5 31.84,57.95 v1(31.54,57.65)
  Bottom Layer w0.28: v1(48.73,45.12) 50.63,47.03 52.85,47.03 v1(54.12,48.3) ; v1(67.92,40.43) 62.63,40.43 61.74,41.31 C34.2
  Bottom Layer w0.305: C1.2 64.68,55.92 v1(58.25,55.92) 57.85,55.92 55.62,53.68 v1(54.66,53.68) 48.91,53.68 v1(48.21,52.98) 47.08,51.86 47.08,45.76 v1(48.23,44.62) ; v1(124.86,76.75) 113.68,87.92 v1(109.87,87.92) ; v1(70.25,39.66) 68.69,39.66 v1(67.92,40.43)
  Bottom Layer w0.406: 90.68,63.54 v1(90.68,62.48) 90.68,60.27 C21.2 R23.1 ; U9.9 89.76,64.47 89.76,65.27 89.07,65.95 U9.4 ; R20.1 95.33,68.92 91.59,68.92 90.68,68.02 v1(90.68,65.81) 90.68,64.54 ; Q1.2 32.52,23.51 v1(33.98,23.51)
  Bottom Layer w0.508: C26.2 95.53,66.32 R20.1
  Bottom Layer w0.61: v1(31.54,57.65) 31.54,57.34 ; 31.54,57.34 34.28,57.34 36.72,59.78 41.6,59.78 43.43,57.95 ; 31.54,57.34 v1(31.54,56.73) ; C35.1 84.84,65.95 U9.4 ; H1.1 4.49,31.15 10.94,31.15 15.39,35.6 v1(15.39,37.7) 15.39,38.9 16.6,40.12 21.02,40.12 24.22,43.32 33.06,43.32 ; v1(41.08,21.69) 41.08,22.59 40.16,23.51 v1(33.98,23.51) ; 39.71,36.99 42.14,34.57 43.56,34.57 43.87,34.87 C9.2
  Bottom Layer w0.762: v1(86.72,44.2) v1(87.84,44.2) v1(87.84,45.17) v1(86.72,45.17)
  Bottom Layer w0.914: v1(47.14,37.5) 44.37,40.27 43,40.27 ; 43,40.27 39.71,36.99 v1(36.98,39.73) 36.55,39.3 35.08,39.3 33.06,41.31 33.06,43.32 ; 43,40.27 39.16,44.11 v1(39.16,44.54) ; v1(78.24,53.27) 82.08,49.42 88.54,49.42 90.98,46.98 90.98,43.32 87.32,39.66 v1(71.09,39.66) ; C8.2 48.36,37.92 53.21,33.06 ICSP1.6
  Bottom Layer w1.219: R0.2 85.49,42.71 87.32,44.54
  vias: v1(0.76,56.73) v1(1.06,25.37) v1(1.14,62.55) v1(1.6,63.92) v1(1.6,61.23) v1(1.52,26.74) v1(1.52,24.05) v1(2.43,22.14) v1(2.69,67.86) v1(2.69,31.28) v1(2.74,23.44) v1(2.82,60.62) v1(2.89,27.24) v1(2.97,64.43) v1(3.45,52.87) v1(3.45,42.71) v1(4.26,24.05) v1(4.34,61.23) v1(4.49,63.77) v1(4.42,26.59) v1(4.47,20.11) v1(4.8,62.55) v1(4.72,25.37) v1(4.97,69.89) v1(6.24,52.62) v1(6.24,50.08) v1(6.24,47.54) v1(6.24,45) v1(6.24,21.68) v1(6.55,57.65) v1(6.88,34.82) v1(7.01,18.84) v1(7.51,71.16) v1(7.51,42.46) v1(7.51,39.92) v1(7.51,37.38) v1(7.77,54.9) v1(7.77,28.08) v1(10.31,71.67) v1(10.56,18.33) v1(12.09,61) v1(12.34,37.12) v1(12.85,48.81) v1(12.85,46.14) v1(12.85,43.73) v1(12.85,41.19) v1(12.95,64.38) v1(12.95,23.54) v1(13.1,72.68) v1(13.36,51.6) v1(13.36,30.52) v1(13.41,65.75) v1(13.41,63.06) v1(13.41,24.91) v1(13.41,22.22) v1(13.56,26.56) v1(14.63,62.45) v1(14.63,21.61) v1(14.78,66.26) v1(14.78,25.41) v1(14.88,61) v1(16.15,63.06) v1(16.15,22.22) v1(16.15,15.79) v1(16.3,65.6) v1(16.3,24.76) v1(16.61,64.38) v1(16.61,50.33) v1(16.66,42.97) v1(16.61,23.54) v1(17.67,76.24) v1(17.67,62.27) v1(18.44,73.19) v1(18.44,53.89) v1(18.94,46.52) v1(18.94,44.05) v1(18.94,12.99) v1(19.71,67.35) v1(19.96,61) v1(19.96,55.41) v1(20.47,79.8) v1(20.47,10.2) v1(20.98,44.74) v1(21.23,40.43) v1(21.79,57.34) v1(21.74,6.64) v1(22.25,21.88) v1(22.4,43.32) v1(22.5,45.51) v1(22.75,59.48) v1(22.75,9.69) v1(23.01,65.57) v1(23.01,12.99) v1(23.2,4.64) v1(23.52,79.29) v1(23.52,16.04) v1(24.02,85.89) v1(25.04,2.83) v1(25.29,16.04) v1(25.55,44.25) v1(25.8,10.2) v1(26.67,84.77) v1(26.97,80.51) v1(27.07,50.33) v1(27.83,66.33) v1(27.83,1.56) v1(28.09,11.47) v1(28.34,89.19) v1(29.36,59.73) v1(29.36,35.09) v1(29.87,16.04) v1(30.02,45.45) v1(30.32,28.69) v1(30.63,88.18) v1(30.63,1.06) v1(31.39,49.32) v1(31.9,34.08) v1(32.17,40.79) v1(32.91,86.15) v1(33.67,76.75) v1(34.18,69.38) v1(34.44,88.18) v1(35.2,46.67) v1(35.71,53.38) v1(36.22,51.35) v1(36.42,3.7) v1(36.72,8.42) v1(37.49,76.75) v1(37.49,63.79) v1(37.99,71.16) v1(38.27,67.66) v1(38.25,42.71) v1(38.76,83.86) v1(41.3,88.43) v1(41.6,26.86) v1(42.31,43.47) v1(43.07,32.04) v1(43.33,50.59) v1(43.5,57.94) v1(43.74,21.68) v1(43.84,54.4) v1(43.84,45.25) v1(45.61,43.47) v1(46.38,77) v1(46.4,74.88) v1(46.78,54.14) v1(47.14,63.22) v1(47.9,68.37) v1(48.41,17.06) v1(49.17,73.7) v1(49.83,77.46) v1(50.54,40.57) v1(50.69,58.46) v1(53.23,80.56) v1(53.74,15.03) v1(53.82,77.41) v1(54.5,58.46) v1(55.32,44.24) v1(55.77,17.82) v1(56.54,80.3) v1(56.79,0.8) v1(57.15,50.33) v1(57.3,41.95) v1(58.06,89.04) v1(58.31,39.92) v1(60.35,82.34) v1(63.95,88.98) v1(63.95,87.36) v1(63.95,85.73) v1(63.95,84.11) v1(64.16,80.56) v1(64.21,77.76) v1(64.21,73.19) v1(64.41,48.81) v1(64.46,18.58) v1(64.46,14.01) v1(64.71,6.03) v1(64.71,4.41) v1(64.71,2.78) v1(64.71,1.16) v1(65.57,88.98) v1(65.57,87.36) v1(65.57,85.73) v1(65.57,84.11) v1(66.34,6.03) v1(66.34,4.41) v1(66.34,2.78) v1(66.34,1.16) v1(67.2,88.98) v1(67.2,87.36) v1(67.2,85.73) v1(67.2,84.11) v1(67.71,50.84) v1(67.96,6.03) v1(67.96,4.41) v1(67.96,2.78) v1(67.96,1.16) v1(68.82,88.98) v1(68.82,87.36) v1(68.82,85.73) v1(68.82,84.11) v1(68.98,53.89) v1(69.08,77.76) v1(69.08,73.19) v1(69.24,9.44) v1(69.34,36.62) v1(69.34,18.58) v1(69.34,14.01) v1(69.49,58.97) v1(69.59,6.03) v1(69.59,4.41) v1(69.59,2.78) v1(69.59,1.16) v1(70.45,88.98) v1(70.45,87.36) v1(70.45,85.73) v1(70.45,84.11) v1(71.21,6.03) v1(71.21,4.41) v1(71.21,2.78) v1(71.21,1.16) v1(72.08,88.98) v1(72.08,87.36) v1(72.08,85.73) v1(72.08,84.11) v1(72.28,29.25) v1(72.84,6.03) v1(72.84,4.41) v1(72.84,2.78) v1(72.84,1.16) v1(73.7,88.98) v1(73.7,87.36) v1(73.7,85.73) v1(73.7,84.11) v1(74.27,77.76) v1(74.27,73.19) v1(74.32,80.56) v1(74.46,6.03) v1(74.46,4.41) v1(74.46,2.78) v1(74.46,1.16) v1(74.52,56.12) v1(74.52,53.38) v1(74.52,18.58) v1(74.52,14.01) v1(75.33,88.98) v1(75.33,87.36) v1(75.33,85.73) v1(75.33,84.11) v1(76.35,48.5) v1(78.18,58.56) v1(78.18,57.65) v1(78.18,56.73) v1(78.24,54.23) v1(78.24,52.31) v1(78.33,86.15) v1(78.48,64.96) v1(78.48,3.72) v1(78.73,87.36) v1(78.94,84.93) v1(78.94,5.1) v1(78.94,2.4) v1(80.16,84.32) v1(80.16,1.79) v1(80.31,88.12) v1(80.31,5.6) v1(81.68,87.36) v1(81.68,84.93) v1(81.68,4.87) v1(81.68,2.4) v1(81.84,10.25) v1(82.14,3.72) v1(82.29,86.15) v1(82.7,17.06) v1(82.98,6.66) v1(83.71,15.03) v1(85,79.75) v1(85,76.73) v1(85,73.66) v1(85.19,12.84) v1(85.24,4.36) v1(85.24,0.8) v1(85.49,10.45) v1(85.75,89.45) v1(85.75,7.15) v1(89.05,58.21) v1(89.68,65.83) v1(89.68,62.48) v1(90.57,58.21)
PGND: length 201.3
  Top Layer w0.254: 113.18,69.89 113.18,67.35 114.45,66.08 119.29,66.08 C10.2
  Top Layer w0.305: U4.4 U4.3 ; U4.9 U4.10
  Top Layer w0.5: 122.04,63.3 122.41,62.93 USB_C.B1A12
  Top Layer w0.508: USB_C.A1B12 v1(122.07,56.53) ; v1(109.68,75.92) 109.68,72.99 C14.1 ; U2.1 v1(117.3,57.82) ; 122.07,53.38 R3.1 ; U6.3 v1(109.68,76.87)
  Top Layer w0.61: C10.2 119.77,66.08 122.04,66.08 122.04,63.3 122.07,63.33 122.07,66.4 123.98,68.31 126.82,68.31 127.51,67.62 R4.1 127.51,66.28 126.69,65.45 126.69,62.73 127.15,62.27 v1(127.15,61) ; 122.07,53.38 v1(122.07,56.53)
  Top Layer w0.914: C14.1 107.08,72.43 104.39,69.74 104.39,51.25 v1(106.83,48.81) ; 64.76,53.97 64.76,56.73 65.93,57.89 67.14,57.89 ; 64.76,53.97 64.76,50.86 v1(64.99,50.64) ; 64.76,53.97 67.14,53.97 ; 122.07,53.38 122.07,41.49 v1(119.02,38.44) ; C18.1 107.89,30.97 110.18,33.26 112.62,33.26 v1(113.43,34.08) ; v1(64.99,50.64) v1(64.15,50.64) 63.84,50.64 C2.2 ; v1(64.99,50.64) 66.21,49.42 73.3,49.42 v1(75.74,46.98) v1(76.35,46.98)
  Bottom Layer w0.254: 127.15,59.73 D1.2 ; R11.2 109.37,78.14 v1(109.68,77.83)
  Bottom Layer w0.508: R15.2 120.53,57.46 120.16,57.82 v1(117.3,57.82) 115.16,57.82 C11.1
  Bottom Layer w0.61: v1(100.84,21.88) 100.84,18.63 C16.2 ; 100.84,21.88 99.89,22.83 v1(99.89,23.15) 99.26,23.78 U8.7 U8.8 99.53,25.05 99.62,24.96 99.62,28.23 ; v1(127.15,61) 127.15,58.79 127.02,58.79 126.2,57.97 123.51,57.97 v1(122.07,56.53) 121.46,55.92 R15.2
  Bottom Layer w0.914: v1(106.83,48.81) 117.19,38.44 ; 117.19,38.44 v1(119.02,38.44) ; 117.19,38.44 117.19,37.83 v1(113.43,34.08) ; v1(75.74,46.98) v1(76.35,46.98) 76.35,43.63 v1(76.04,43.32)
  Bottom Layer w1.016: v1(77.26,43.32) v1(77.26,42.41) ; v1(98.94,24.42) 96.89,24.42 ; v1(76.04,42.41) 77.11,42.41 77.11,43.32 v1(76.04,43.32)
  Bottom Layer w1.219: R0.1 77.11,42.71
  vias: v1(95.45,18.39) v1(95.45,17.12) v1(97.04,18.39) v1(97.04,17.12) v1(98.62,18.39) v1(98.62,17.12) v1(98.94,23.15) v1(98.94,21.88) v1(99.89,26.96) v1(99.89,24.42) v1(99.89,21.88) v1(100.21,28.86) v1(100.85,24.42) v1(100.85,23.15) v1(101.95,28.08) v1(101.95,26.86) v1(107.78,83.22) v1(107.78,82.27) v1(107.78,81.32) v1(107.78,80.37) v1(109.69,78.78) v1(110.64,78.78) v1(110.6,77.83) v1(110.64,76.87) v1(110.64,75.92) v1(111.59,78.78) v1(111.59,77.83) v1(111.59,76.87) v1(111.59,75.92)
(no net): length 31.6
  Top Layer w1.219: NOREF#12.102 4.72,80.7 4.72,83.1 7,85.38 H3.1 ; H3.2 9.54,85.38 11.83,83.1 11.83,80.68 NOREF#6.103
  Bottom Layer w1.219: H2.1 9.51,11.51 11.92,9.09 NOREF.103 ; H2.2 6.97,11.18 4.72,8.93 4.72,6.55 NOREF#8.102
  vias: v1(123.05,83) v1(123.05,8) v1(123.51,84.38) v1(123.51,81.68) v1(123.51,9.37) v1(123.51,6.68) v1(124.73,81.07) v1(124.73,6.07) v1(124.88,84.88) v1(124.88,9.88) v1(126.18,84.32) v1(126.25,81.68) v1(126.25,9.14) v1(126.25,6.68) v1(126.71,83) v1(126.71,8)
+BAT: length 201.9
  Top Layer w0.305: FPC1.9 40.08,21.68
  Top Layer w0.508: U6.5 113.54,72.8 113.18,72.43 C14.2
  Top Layer w0.61: SW2.3 v1(128.08,44.49)
  Bottom Layer w0.305: 89.15,12.64 85.75,16.04 42.67,16.04 40.08,18.63 v1(40.08,21.68) ; 103.53,9.18 107.84,9.18 123.59,24.93 123.59,30.52 129.18,36.11 129.18,42.77 128.08,43.87 v1(128.08,44.49)
  Bottom Layer w0.508: 99.53,9.51 BT1.1 92.28,9.51 v1(91.59,10.2) 91.59,11.3 Q5.2 ; 99.53,9.51 Q3.2 ; 99.53,9.51 102.33,9.51 103.34,10.52 Q2.2
  Bottom Layer w1.016: v1(111.91,71.48) v1(111.91,72.43)
  Bottom Layer w1.219: v1(90.32,11.47) 89.15,12.64 89.15,33.57 90.37,34.79 94.02,34.79 102.56,43.32 102.56,62.13 v1(111.91,71.48)
  vias: v1(90.32,10.2) v1(91.59,8.93) v1(93.18,10.2) v1(93.18,8.93) v1(97.94,10.2) v1(97.94,8.93) v1(99.21,10.2) v1(99.21,8.93) v1(100.16,10.2) v1(100.16,8.93) v1(101.11,10.2) v1(101.11,8.93) v1(102.38,10.2) v1(102.38,8.93)
A0: length 11.1
  Top Layer w0.178: U1.97 40.07,32.33 40.07,24.42 39.08,23.42 FPC1.7
A1: length 8.9
  Top Layer w0.178: FPC1.8 39.58,32.54 U1.96
A2: length 11.9
  Top Layer w0.178: FPC1.5 38.08,23.41 39.08,24.42 39.08,32.76 U1.95
A3: length 9.7
  Top Layer w0.178: U1.94 38.58,32.96 FPC1.6
A4: length 12.8
  Top Layer w0.178: U1.93 38.07,33.16 38.07,24.42 37.08,23.43 FPC1.3
A5: length 10.5
  Top Layer w0.178: U1.92 37.58,33.37 FPC1.4
AREF: length 11
  Top Layer w0.178: 41.42,32.97 40.58,32.14 40.58,25.3 FPC1.10
  Top Layer w0.28: 41.42,32.97 42.37,33.93 v1(42.37,35.6)
BAT_EN: length 78.8
  Top Layer w0.305: v1(121.05,29.76) 116.47,34.33 116.47,35.6 110.64,41.44 107.59,41.44 v1(100.48,48.55)
  Bottom Layer w0.305: v1(100.48,48.55) 100.48,68.87 97.94,71.41 91.08,71.41 90.06,72.43 R13.2 ; v1(121.05,29.76) 128.08,36.78 v1(128.08,41.99)
BT_PWRC: length 50
  Top Layer w0.305: U3.14 50.57,77.14 47.48,74.05 42.91,74.05 37.48,68.62 33.42,68.62 31.13,66.33 v1(31.13,64.56) ; 35.05,44.57 30.12,49.5 v1(30.12,53.89)
  Bottom Layer w0.305: v1(30.12,53.89) 30.12,63.54 v1(31.14,64.56)
BT_RX: length 18.1
  Top Layer w0.305: v1(46.12,52.11) 46.68,51.55 46.68,50.96 U1.46 ; R35.1 41.28,62.02 v1(42.06,62.02) 42.83,62.02 R34.2
  Bottom Layer w0.305: v1(42.06,62.02) 43.02,62.02 47.65,57.39 47.65,53.63 v1(46.12,52.11)
BT_STAT: length 33.8
  Top Layer w0.305: U3.16 47.64,78.91 v1(47.64,77.51) ; v1(52.22,58.46) 48.91,55.16 46.63,55.16 45.1,53.63 45.1,52.21 U1.50
  Bottom Layer w0.305: v1(52.22,58.46) 52.22,72.94 v1(47.65,77.51)
BT_TX: length 25.2
  Top Layer w0.305: U3.1 34.07,63.9 v1(37.23,60.75) ; v1(46.12,53.63) 47.39,52.36 47.39,50.96 U1.45
  Bottom Layer w0.305: v1(46.12,53.63) 46.12,56.78 42.21,60.69 37.28,60.69 v1(37.23,60.75)
BTN0: length 8.5
  Top Layer w0.305: U1.51 42.43,51.94 42.43,53.38 v1(42.37,53.38)
  Bottom Layer w0.305: v1(38.5,57.86) 39.35,57.86 42.37,54.84 v1(42.37,53.38)
BTN1: length 7.9
  Top Layer w0.178: v1(41.74,52.74) 41.49,52.74 41.1,52.36 41.1,51.95 U1.52
  Top Layer w0.305: FPC2.15 38,55.47 v1(38.25,55.22)
  Bottom Layer w0.305: v1(41.74,52.74) 39.26,55.22 v1(38.25,55.22)
BTN2: length 15.4
  Top Layer w0.178: v1(37.49,50.03) 37.5,50.04 FPC2.14
  Top Layer w0.305: U1.70 34.44,45.89 34.44,47.03 v1(36.03,48.62)
  Bottom Layer w0.305: v1(36.03,48.62) 37.44,50.03 v1(37.49,50.03)
BUZZ: length 11.9
  Top Layer w0.305: U1.78 33.66,39.36 v1(33.66,38.44)
  Bottom Layer w0.305: R1.2 32.15,29.91 33.66,31.42 v1(33.66,38.44)
D0: length 14.6
  Top Layer w0.178: U1.2 45.58,31.92 45.58,31.5 43.07,29 43.07,24.56 42.08,23.56 FPC1.13
  Top Layer w0.305: FPC1.13 42.08,20.02 R7.1
D1: length 23.3
  Top Layer w0.178: 45.24,32.97 46.17,32.03 46.17,31.45 43.58,28.86 FPC1.16
  Top Layer w0.305: R8.1 45.26,19.99 v1(45.26,21.68)
  Bottom Layer w0.305: v1(46.17,32.04) 43.43,29.3 43.43,25.64 45.26,23.81 v1(45.26,21.68)
D2: length 10.2
  Top Layer w0.178: FPC1.18 44.6,25.31 44.6,28.64 47.24,31.28 47.24,33.09 U1.6
D3: length 13.3
  Top Layer w0.178: U1.7 47.7,33.34 47.7,31.08 45.08,28.46 45.08,27.48 45.09,27.47 45.09,25.53 45.08,25.52 45.08,24.42 44.08,23.42 FPC1.17
D4: length 7.8
  Top Layer w0.178: FPC1.14 42.58,30.31 U1.1
D5: length 12.5
  Top Layer w0.152: 44.09,28.74 44.09,24.31
  Top Layer w0.178: 44.09,28.74 46.78,31.43 46.78,32.84 U1.5 ; FPC1.15 43.08,23.3 44.09,24.31
D6: length 14
  Top Layer w0.178: U1.15 50.59,36.1 50.59,31.43 46.96,27.8 46.96,26.53 46.58,26.15 FPC1.22
D7: length 17
  Top Layer w0.178: U1.16 50.95,36.45 50.95,31.1 47.36,27.52 47.36,26.35 47.08,26.07 47.08,24.42 46.08,23.41 FPC1.21
D8: length 14.6
  Top Layer w0.178: FPC1.24 47.58,25.88 47.75,26.06 47.75,27.33 51.26,30.84 51.26,36.84 50.18,37.92
D9: length 17.5
  Top Layer w0.178: FPC1.23 47.08,23.42 48.08,24.42 48.08,27.01 51.58,30.52 51.58,37.23 50.54,38.27
D10: length 17.8
  Top Layer w0.178: FPC1.26 48.58,26.88 51.9,30.2 51.9,34.33 54.12,36.55 54.12,38.23 U1.23
D11: length 20.7
  Top Layer w0.178: U1.24 54.44,38.62 54.44,36.23 52.22,34.01 52.22,29.88 49.09,26.76 49.09,24.42 48.08,23.41 FPC1.25
D12: length 18.3
  Top Layer w0.178: FPC1.28 49.58,26.61 52.53,29.57 52.53,33.69 54.76,35.92 54.76,39.01 U1.25
D13: length 23.4
  Top Layer w0.178: U1.26 55.08,41.09 55.08,35.6 52.85,33.38 52.85,29.25 50.09,26.48 50.09,24.42 49.08,23.41 FPC1.27
D30: length 8.5
  Top Layer w0.178: U1.60 38.25,49.15 38.25,54.29 39,55.04 FPC2.17
D31: length 10.5
  Top Layer w0.178: U1.59 38.6,49.5 38.6,54.09 39.49,54.98 39.49,58.63 FPC2.18
D32: length 7.9
  Top Layer w0.178: FPC2.19 39.99,54.93 38.95,53.88 38.95,49.86 U1.58
D33: length 9.9
  Top Layer w0.178: U1.57 39.31,50.21 39.31,53.65 40.51,54.85 40.51,58.62 FPC2.20
D34: length 7.4
  Top Layer w0.178: FPC2.21 41,54.71 39.66,53.37 39.66,50.56 U1.56
D35: length 9.3
  Top Layer w0.178: FPC2.22 41.51,58.62 41.51,54.68 40.02,53.19 40.02,50.92 U1.55
D36: length 6.8
  Top Layer w0.178: U1.54 40.37,51.27 40.37,52.96 42.06,54.65 42.06,56.32 FPC2.23
D37: length 8.7
  Top Layer w0.178: FPC2.24 42.49,58.62 42.49,54.45 40.72,52.68 40.72,51.63 41.42,50.93
GYRO_INT: length 31.6
  Top Layer w0.28: v1(56.66,40.68) 62.67,40.68 v1(63.94,41.95) 63.98,41.95 U11.12 ; U1.69 37.3,43.73 39.42,43.73 41.45,41.69 53.42,41.69 v1(54.12,41)
  Bottom Layer w0.28: v1(56.66,40.68) 54.44,40.68 v1(54.12,41)
IR_LINE1: length 37.5
  Top Layer w0.305: H1.3 4.49,36.23 13.48,36.23 17.93,31.79 33.88,31.79 U1.89
IR_LINE2: length 37.8
  Top Layer w0.305: H1.4 4.49,38.77 11.89,38.77 18.24,32.42 33.8,32.42 U1.88
IR_LINE3: length 38.1
  Top Layer w0.305: H1.5 4.49,41.31 10.31,41.31 18.56,33.06 33.73,33.06 U1.87
IR_LINE4: length 38.9
  Top Layer w0.305: H1.6 4.49,43.85 8.91,43.85 14.01,38.75 21.07,38.75 23.01,40.68 26.56,40.68 32.15,35.09 35.05,35.09 U1.86
IR_LINE5: length 37.6
  Top Layer w0.305: U1.85 34.96,35.7 32.45,35.7 26.84,41.31 14.12,41.31 9.04,46.39 4.49,46.39 H1.7
IR_LINE6: length 38
  Top Layer w0.305: H1.8 4.49,48.93 8.91,48.93 13.91,43.93 17.82,43.93 19.8,41.95 27.12,41.95 32.76,36.31 34.86,36.31 36.47,37.92
IR_LINE7: length 38.3
  Top Layer w0.305: 36.12,38.27 34.76,36.92 33.07,36.92 27.4,42.58 21.61,42.58 17.83,46.37 13.76,46.37 8.66,51.47 4.49,51.47 H1.9
IR_LINE8: length 38.7
  Top Layer w0.305: H1.10 4.49,54.01 8.96,54.01 13.56,49.42 17.44,49.42 23.64,43.22 27.68,43.22 33.37,37.53 34.66,37.53 U1.82
IR_LINE_ON: length 53.5
  Top Layer w0.305: U1.74 33.99,43.52 30.45,47.05 21.08,47.05 13.84,54.29 v1(12.34,54.29)
  Bottom Layer w0.305: H1.2 4.49,33.69 10.31,33.69 11.32,34.71 11.32,53.28 v1(12.34,54.29)
M1_IN1: length 14
  Top Layer w0.305: U4.21 56.38,54.29 49.13,47.04
M1_IN2: length 13.6
  Top Layer w0.305: U4.22 56.43,53.64 U1.36
M1_PWM: length 13.9
  Top Layer w0.305: U4.23 58.28,52.99 58.03,52.74 v1(56.66,52.74) ; U1.38 53.8,52.43 v1(53.8,52.74)
  Bottom Layer w0.305: v1(56.66,52.74) v1(53.81,52.74)
M2_IN1: length 15.9
  Top Layer w0.305: 60.16,56.89 56.15,56.89 U1.41
M2_IN2: length 16.4
  Top Layer w0.305: U1.42 56.05,57.51 60.12,57.51 U4.16
M2_PWM: length 17.6
  Top Layer w0.305: v1(56.84,56.12) 56.08,56.12 U1.40 ; v1(56.76,58.18) 56.78,58.19 U4.15
  Bottom Layer w0.305: v1(56.84,56.12) 56.84,58.1 v1(56.77,58.18)
M_STBY: length 19.6
  Top Layer w0.305: v1(62.38,57.19) 62.38,55.92 62.05,55.59 58.88,55.59 v1(58.25,54.97) ; v1(58.25,51.79) 55.29,51.79 U1.35
  Bottom Layer w0.305: v1(58.25,54.97) v1(58.25,51.79)
MISO: length 16.1
  Top Layer w0.178: 51.95,39.69 53.49,38.15 v1(53.49,37.82)
  Bottom Layer w0.305: v1(53.49,37.82) 63.97,37.82 ICSP1.1
MOSI: length 17
  Top Layer w0.178: v1(52.22,35.6) 52.85,36.23 52.85,38.08 51.6,39.33
  Bottom Layer w0.305: ICSP1.4 62.38,34.33 59.84,34.33 58.57,35.6 v1(52.22,35.6)
POT1: length 13.6
  Top Layer w0.178: U1.91 37.08,33.58 37.08,24.39 36.08,23.38 FPC1.1
POT2: length 11.3
  Top Layer w0.178: U1.90 36.58,33.79 FPC1.2
RESET: length 82.9
  Top Layer w0.305: v1(68.42,34.33) 62.32,34.33 61.11,35.55 ICSP1.5 56.34,35.6 55.71,36.23 55.71,42.58 v1(53.17,45.12) 53.12,45.17 52.2,45.17 51.6,44.57 ; v1(36.02,54.33) 36,54.36 FPC2.11 ; v1(92.8,36.62) 94.02,35.4 v1(97.68,35.4)
  Bottom Layer w0.178: 48.41,42.9 50.63,45.12 v1(53.17,45.12)
  Bottom Layer w0.305: v1(92.8,36.62) 70.71,36.62 v1(68.42,34.33) ; v1(36.02,54.33) 47.45,42.9 48.41,42.9 ; C13.2 v1(97.68,35.4)
RX2: length 1.9
  Top Layer w0.178: FPC1.20 45.58,26.74 v1(45.87,27.03)
RXD: length 138
  Top Layer w0.305: v1(125.37,31.03) 125.37,35.35 v1(122.83,37.89) ; v1(119.31,46.39) 120.16,46.39 120.8,47.03 120.8,49.57 119.84,50.52 119.84,58.14 117.62,60.36 U2.3 ; R8.2 52.45,17.84 53.99,16.3 80.41,16.3 82.44,14.26 82.44,11.72 89.55,4.61 v1(91.08,4.61)
  Bottom Layer w0.305: v1(91.08,4.61) 105.56,4.61 125.37,24.42 v1(125.37,31.03) ; v1(122.83,37.89) 119.31,41.41 v1(119.31,46.39)
SCK: length 14.7
  Top Layer w0.178: v1(52.22,36.87) 52.22,38.01 U1.20
  Bottom Layer w0.305: ICSP1.3 62.06,37.19 60.16,37.19 59.84,36.87 v1(52.22,36.87)
SCL: length 52.6
  Top Layer w0.28: U1.43 49.36,51.52 v1(49.36,51.79) ; v1(69.68,43.85) 69.68,44.17 69.2,44.65 U11.23
  Top Layer w0.305: v1(45.55,47.66) 45.55,47.71 U1.43
  Bottom Layer w0.305: v1(49.36,51.79) 51.58,49.57 55.47,49.57 57.45,47.59 69.64,47.59 71.27,45.96 71.27,43.22 70.95,42.9 R29.1 69.73,43.81 v1(69.68,43.85) ; v1(36.66,58.14) 36.24,57.73 36.24,55.07 43.64,47.66 v1(45.55,47.66)
SDA: length 43.4
  Top Layer w0.28: U11.24 69.7,45.15 v1(69.73,45.12)
  Top Layer w0.305: v1(48.09,51.47) 48.09,50.95 U1.44 45.75,48.62 v1(45.23,48.62)
  Bottom Layer w0.305: v1(69.73,45.12) 69.78,45.18 69.78,46.22 69.03,46.98 56.84,46.98 54.86,48.96 50.6,48.96 v1(48.09,51.47) ; v1(45.23,48.62) 43.64,48.62 36.9,55.36 v1(36.9,57.19)
SENS_L: length 24.5
  Top Layer w0.305: U1.72 29.1,49.81 29.1,54.29 25.14,58.26 v1(25.14,61.3)
  Bottom Layer w0.61: U12.7 25.12,61.5 R32.2
SENS_R: length 35.9
  Top Layer w0.305: v1(23.92,72.58) 23.92,58.56 28.19,54.29 28.19,50.02 U1.73
  Bottom Layer w0.61: U12.1 23.84,72.74 R30.2
SONAR_ECHO: length 21.1
  Top Layer w0.305: U1.75 30.4,46.39 v1(21.74,46.39)
  Bottom Layer w0.305: U5.2 19.71,45.25 20.85,46.39 v1(21.74,46.39)
SONAR_TRIG: length 23.2
  Top Layer w0.305: v1(23.92,45.45) 28.93,45.45 U1.76
  Bottom Layer w0.305: v1(23.92,45.45) 22.7,44.24 21.79,44.24 19.25,41.7 15.39,41.7 U5.3
TX2: length 10.8
  Top Layer w0.178: FPC1.19 45.07,23.43 46.07,24.42 46.07,26.39 46.46,26.78 46.46,28.26 v1(49.99,31.79)
TXD: length 141.7
  Top Layer w0.305: v1(123.34,39.41) 126.89,35.85 v1(126.89,32.3) ; U2.2 117.62,59.09 119.21,57.51 119.21,49.03 v1(119.31,48.93) ; R7.2 42.21,17.78 42.21,16.5 42.51,16.19 51.05,16.19 59.33,7.91 83.46,7.91 88.79,2.58 v1(90.82,2.58)
  Bottom Layer w0.305: v1(90.83,2.58) 106.07,2.58 126.89,23.41 v1(126.89,32.3) ; v1(123.34,39.41) 123.34,44.91 v1(119.31,48.93)
USB_DN: length 16.4
  Top Layer w0.508: U2.6 113.81,64.17 v1(113.18,63.54)
  Bottom Layer w0.305: D1.4 122.14,58.78 121.5,59.41 114.77,59.41 112.86,61.32 112.86,63.22 v1(113.18,63.54)
USB_DP: length 10.8
  Top Layer w0.508: 115.91,62.9 v1(114.45,62.9)
  Bottom Layer w0.305: D1.6 122.13,60.68 121.47,61.34 116.01,61.34 v1(114.45,62.9)
USBVCC: length 36.2
  Top Layer w0.508: U2.16 112.13,57.82 ; 112.13,57.82 112.22,57.82 v1(112.54,58.14) 112.86,58.46 112.86,61 v1(113.81,61.95) ; 112.13,57.82 113.42,56.54 C12.2 113.42,53.5 113.84,53.07 ; 113.84,53.07 113.84,50.03 114.45,49.42 R6.1 112.01,48.59 D2.1 ; 113.84,53.07 115.43,53.07 R5.1 ; C10.1 119.53,61.32 v1(120.16,60.68)
  Bottom Layer w0.305: D1.5 122.07,59.73 121.11,60.68 v1(120.16,60.68)
  Bottom Layer w0.508: v1(113.81,61.95) 115.4,60.36 119.84,60.36 v1(120.16,60.68)
  vias: v1(118.63,63.7)
VUSB: length 25.3
  Top Layer w0.5: 121.29,57.33 120.8,56.84 v1(120.8,54.01) ; 121.29,57.33 121.29,61.35 v1(122.07,62.13) USB_C.B4A9 ; 121.29,57.33 USB_C.A4B9
  Top Layer w0.508: v1(119.53,68.55) 118.33,68.55 117.26,69.62 R10.1
  Bottom Layer w0.5: FU1.1 121.48,67.93 122.07,67.35 v1(122.07,62.13)
  Bottom Layer w0.508: v1(120.8,54.01) 120.8,53.65 R14.2
WS2812: length 37.1
  Top Layer w0.305: U1.77 32.96,39.36 v1(32.76,39.36) ; v1(23.01,18.02) 24.33,16.7 24.33,8.88 LED6.1
  Bottom Layer w0.305: v1(32.76,39.36) 32.76,32.65 27.58,27.47 27.58,25.64 23.01,21.07 v1(23.01,18.02) 23.01,17.72
~CHRG: length 122.2
  Top Layer w0.178: U1.63 37.18,48.09 37.18,48.85 34.94,51.09 34.94,54.9 35.51,55.47 35.51,57.19 36.01,57.69 36.01,59.48 36.51,59.98 39.26,59.98 40.02,60.75 v1(40.02,63.54)
  Top Layer w0.305: v1(52.22,74.97) 49.68,72.43 46.88,72.43 42.57,68.11 v1(40.79,68.11)
  Top Layer w0.508: LED3.2 v1(116.73,76.24) 116.17,76.24 114.27,78.14 U6.7
  Bottom Layer w0.305: v1(116.72,76.24) 116.72,81.84 113.18,85.38 90.82,85.38 87.01,81.57 56.03,81.57 52.47,78.02 52.47,75.22 v1(52.22,74.97) ; v1(40.79,68.11) 40.79,64.3 v1(40.02,63.54)
~SENS_EN: length 57.8
  Top Layer w0.305: U1.19 48.58,40.93 40.79,40.93 40.28,41.44 34.69,41.44 v1(34.18,41.95) ; R38.1 16.4,68.62 19.45,65.57 19.45,62.27 17.42,60.24 17.42,56.43 24.53,49.32 27.58,49.32 v1(28.85,48.05)
  Bottom Layer w0.305: v1(34.18,41.95) 34.18,44.74 30.88,48.05 v1(28.85,48.05)
$1N3375: length 7.3
  Bottom Layer w0.61: Q1.3 28.49,24.12 25.14,20.77 BUZZER1.2
$1N3378: length 2
  Bottom Layer w0.61: Q1.1 32.15,25.1 R1.1
$1N9699: length 6.1
  Top Layer w0.28: 54.68,49.96 54.44,49.96 X1.3 52.22,48.02 50.18,45.98
$1N9712: length 7.2
  Top Layer w0.28: 56.27,48.55 54.4,46.67 X1.1 53.24,46.08 52.22,46.08 51.92,46.37 51.28,46.37 50.54,45.63
$1N10624: length 17.8
  Bottom Layer w0.254: 127.16,55.41 127.15,55.42 L1.2 127.77,56.86 128.25,57.34 USB_C.1 USB_C.1 ; 127.16,55.41 USB_C.1 ; 127.16,55.41 USB_C.1
$1N10918: length 6.7
  Top Layer w0.254: v1(125.88,60.48) USB_C.B6 122.38,60.48 122.08,60.17 122.08,59.81 122.41,59.48 USB_C.A6
  Bottom Layer w0.254: v1(125.88,60.48) 125.68,60.68 D1.1
$1N10981: length 7.4
  Top Layer w0.2: R3.2 127.51,54.28 125.88,55.92 125.88,57.19 124.59,58.48 USB_C.A5
$1N11074: length 6.8
  Top Layer w0.254: R4.2 125.88,66.03 125.88,62.59 124.77,61.48 USB_C.B5
$1N11370: length 8.6
  Top Layer w0.305: U2.4 114.76,61.63 113.81,60.68 113.81,57.82 115.48,56.16 C12.1
$1N11559: length 7.3
  Top Layer w0.305: 111.98,69.89 111.98,67.28 113.81,65.44 U2.7
$1N11562: length 3.8
  Top Layer w0.305: U2.8 115.91,67.15 114.38,68.69 114.38,69.89
$1N11598: length 31
  Top Layer w0.305: U2.13 v1(108.42,61.63)
  Bottom Layer w0.305: v1(108.42,61.63) 104.39,57.61 104.39,38.02 C13.1
$1N11886: length 3.4
  Top Layer w0.508: R5.2 116.36,51.16 117.19,50.33 117.19,48.95 LED1.1
$1N11890: length 2.1
  Top Layer w0.508: LED2.1 115.17,46.39 115.14,46.37
$1N24194: length 6
  Top Layer w0.254: LED3.1 119.31,76.73 R12.1
  Top Layer w0.508: LED4.1 119.26,73.75 119.26,76.19 LED3.1
$1N24238: length 5.6
  Top Layer w0.508: U6.6 114.27,76.87 115.72,75.42 115.72,74.33 116.35,73.7 LED4.2
$1N24335: length 0.9
  Top Layer w0.254: v1(106.78,78.14) U6.2
$1N24524: length 39.6
  Top Layer w0.508: v1(106.83,75.6) U6.4 ; R10.2 120.8,71.16 122.07,72.43 122.07,77.51 120.8,78.78 R12.2 119.26,79.37 118.57,80.05 115.72,80.05 115.08,79.41 U6.8 113.54,82.32 v1(113.81,82.59)
  Bottom Layer w0.508: v1(106.83,75.6) 106.83,74.65 107.78,73.7 113.18,73.7 113.81,74.33 v1(113.81,82.59)
$1N24951: length 41.6
  Bottom Layer w1.27: U8.1 v1(115.77,25.05) v1(116.72,25.05) ; v1(116.72,23.78) v1(115.77,23.78) U8.2 ; 102.71,24.39 116.67,24.39
$1N25055: length 9.8
  Top Layer w0.61: v1(95.77,22.51) 95.77,27.28 v1(96.72,28.23)
  Bottom Layer w0.61: 95.13,28.3 95.19,28.23 v1(96.72,28.23) 97.62,28.23 ; U8.6 v1(95.76,22.51)
$1N26007: length 3.3
  Bottom Layer w0.508: U9.7 93.83,63.41 R19.2
$1N26048: length 2.5
  Bottom Layer w0.508: C21.1 92.95,60.05 U9.8
$1N26110: length 7
  Bottom Layer w0.61: C22.2 81.53,62.83 82.22,62.14 U9.1
$1N26326: length 19.8
  Top Layer w1.219: D3.1 77.26,61.97 77.26,65.57 78.78,67.1 81.22,67.1 ; v1(86.1,64.66) 83.25,67.51 L2.1
  Bottom Layer w0.61: v1(86.1,64.66) 87.38,64.66 U9.3
  vias: v1(81.53,66.44)
$1N26586: length 3
  Bottom Layer w0.508: R20.2 97.53,68.16 97.99,67.7 C25.2
$1N26616: length 5.4
  Bottom Layer w0.508: U9.6 94.01,64.68 94.64,64.05 95.36,64.05 C26.1 C25.1
$1N26891: length 20.9
  Top Layer w0.406: v1(87.32,59.78) 87.32,66.49 88.54,67.7 93.41,67.7 94.08,67.04 v1(94.08,65.97)
  Bottom Layer w0.508: R23.2 R21.1 R22.1
  Bottom Layer w0.61: v1(94.08,65.97) 94.06,65.95 U9.5
$1N27650: length 7.1
  Bottom Layer w1.27: C30.1 93.73,78.3 U7.3
  Bottom Layer w1.524: BT1.2 93.12,79.73 C30.1
$1N34996: length 9.5
  Top Layer w0.178: U1.12 49.11,35.46 49.11,31.54 v1(45.87,28.3)
